# EAGLE design picade (EAGLE 6.6.0)
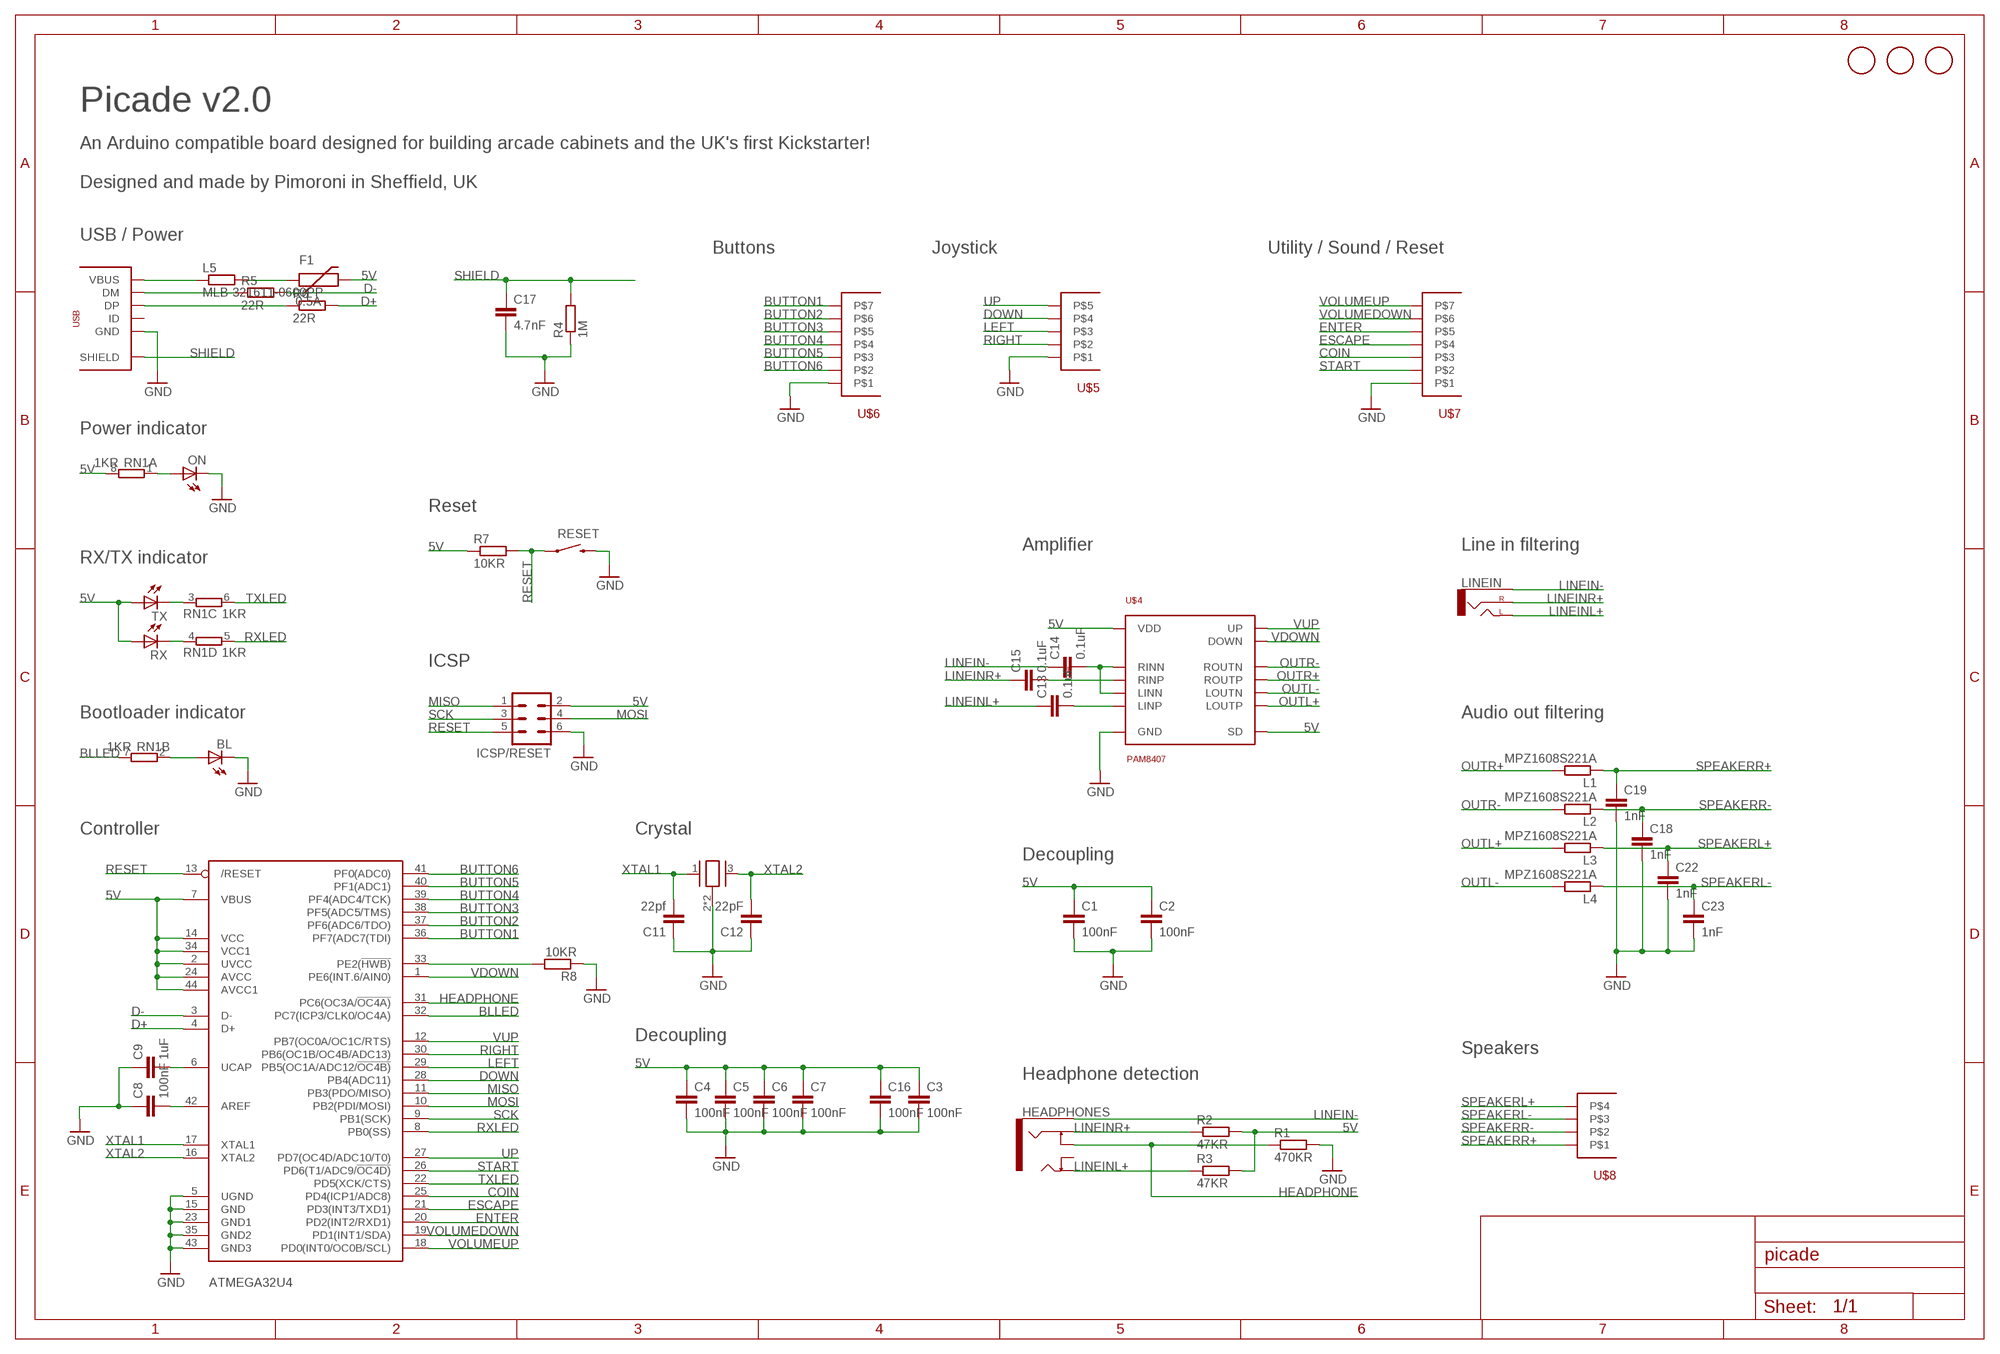
[diagram p0: schematic, sheet 1]

## Parts
16MHZ  TSX-3225  [TSX-3225]
ATMEGA32U4  ATMEGA32U4-AU  [TQFP44]
BL  LEDCHIPLED_0805  [CHIPLED_0805]
C1  100nF  C-EUC0603K  [C0603K]
C2  100nF  C-EUC0603K  [C0603K]
C3  100nF  C-EUC0603K  [C0603K]
C4  100nF  C-EUC0603K  [C0603K]
C5  100nF  C-EUC0603K  [C0603K]
C6  100nF  C-EUC0603K  [C0603K]
C7  100nF  C-EUC0603K  [C0603K]
C8  100nF  C-EUC0603K  [C0603K]
C9  1uF  C-EUC0603K  [C0603K]
C11  22pf  C-EUC0603K  [C0603K]
C12  22pF  C-EUC0603K  [C0603K]
C13  0.1uF  C-EUC0603K  [C0603K]
C14  0.1uF  C-EUC0603K  [C0603K]
C15  0.1uF  C-EUC0603K  [C0603K]
C16  100nF  C-EUC0805K  [C0805K]
C17  4.7nF  C-EUC0603K  [C0603K]
C18  1nF  C-EUC0603K  [C0603K]
C19  1nF  C-EUC0603K  [C0603K]
C22  1nF  C-EUC0603K  [C0603K]
C23  1nF  C-EUC0603K  [C0603K]
F1  0.5A  PTCSMD  [PTC-1206]
HEADPHONES  stereo-jack-switched  AUDIO-JACK2SMD  [AUDIO-JACK-3.5MM-SMD]
ICSP/RESET  MA03-2  [MA03-2]
L1  MPZ1608S221A  R-EU_R0603  [R0603]
L2  MPZ1608S221A  R-EU_R0603  [R0603]
L3  MPZ1608S221A  R-EU_R0603  [R0603]
L4  MPZ1608S221A  R-EU_R0603  [R0603]
L5  MLB-321611-0600PP  R-EU_R1206  [R1206]
LINEIN  stereo-jack-noswitch  AUDIO-JACKSMD2  [AUDIO-JACK-3.5MM-SMD]
ON  LEDCHIPLED_0805  [CHIPLED_0805]
R1  470KR  R-EU_R0603  [R0603]
R2  47KR  R-EU_R0603  [R0603]
R3  47KR  R-EU_R0603  [R0603]
R4  1M  R-EU_R0603  [R0603]
R5  22R  R-EU_R0603  [R0603]
R6  22R  R-EU_R0603  [R0603]
R7  10KR  R-EU_R0603  [R0603]
R8  10KR  R-EU_R0603  [R0603]
RESET  gullwing-switch  SWITCH-MOMENTARY-2-SMD-1101NE  [TACTILE-SWITCH-1101NE]
RN1  1KR  4R-N0603-ARC  [0603-ARC]
RX  LEDCHIPLED_0805  [CHIPLED_0805]
TX  LEDCHIPLED_0805  [CHIPLED_0805]
U$1  FIDUCIAL1MM  [FIDUCIAL-1MM]
U$2  FIDUCIAL1MM  [FIDUCIAL-1MM]
U$3  FIDUCIAL1MM  [FIDUCIAL-1MM]
U$4  PAM8407  [SO-16]
U$5  5-WAY  [1X5-3.5MM-SCREWTERMINAL]
U$6  7-WAY  [1X7-3.5MM-SCREWTERMINAL]
U$7  7-WAY  [1X7-3.5MM-SCREWTERMINAL]
U$8  4-WAY  [1X4-3.5MM-SCREWTERMINAL]
U$13  USBMICROB  [MICROB-USB]

## Nets
5V: ATMEGA32U4.2(UVCC) ATMEGA32U4.7(VBUS) ATMEGA32U4.14(VCC) ATMEGA32U4.24(AVCC) ATMEGA32U4.34(VCC1) ATMEGA32U4.44(AVCC1) C1.1 C2.1 C3.1 C4.1 C5.1 C6.1 C7.1 C16.1 F1.2 ICSP/RESET.2 R2.2 R3.2 R7.1 RN1.8 RX.A TX.A U$4.3(SD) U$4.9(VDD) U$4.16(VDD)
BLLED: ATMEGA32U4.32(PC7(ICP3/CLK0/OC4A)) RN1.7
BUTTON1: ATMEGA32U4.36(PF7(ADC7(TDI)) U$6.7
BUTTON2: ATMEGA32U4.37(PF6(ADC6/TDO)) U$6.6
BUTTON3: ATMEGA32U4.38(PF5(ADC5/TMS)) U$6.5
BUTTON4: ATMEGA32U4.39(PF4(ADC4/TCK)) U$6.4
BUTTON5: ATMEGA32U4.40(PF1(ADC1)) U$6.3
BUTTON6: ATMEGA32U4.41(PF0(ADC0)) U$6.2
COIN: ATMEGA32U4.25(PD4(ICP1/ADC8)) U$7.3
D+: ATMEGA32U4.4(D+) R6.2
D-: ATMEGA32U4.3(D-) R5.2
DOWN: ATMEGA32U4.28(PB4(ADC11)) U$5.4
ENTER: ATMEGA32U4.20(PD2(INT2/RXD1)) U$7.5
ESCAPE: ATMEGA32U4.21(PD3(INT3/TXD1)) U$7.4
GND: 16MHZ.2(GND) 16MHZ.4(GND) ATMEGA32U4.5(UGND) ATMEGA32U4.15(GND) ATMEGA32U4.23(GND1) ATMEGA32U4.35(GND2) ATMEGA32U4.43(GND3) BL.C C1.2 C2.2 C3.2 C4.2 C5.2 C6.2 C7.2 C8.1 C9.1 C11.1 C12.1 C16.2 C17.2 C18.2 C19.2 C22.2 C23.2 ICSP/RESET.6 ON.C R1.2 R4.1 R8.1 RESET.P$2 U$4.6(GND) U$4.12(GND) U$4.13(GND) U$5.1 U$6.1 U$7.1 U$13.GND
HEADPHONE: ATMEGA32U4.31(PC6(OC3A/!OC4A)) HEADPHONES.RSH R1.1
LEFT: ATMEGA32U4.29(PB5(OC1A/ADC12/!OC4B)) U$5.3
LIENINLCAP: C13.2 U$4.8(LINP)
LINEIN-: C14.1 HEADPHONES.SLEEVE LINEIN.SLEEVE
LINEINL+: C13.1 HEADPHONES.TIP LINEIN.TIP(LEFT) R3.1
LINEINR+: C15.1 HEADPHONES.RING LINEIN.RING(RIGHT) R2.1
LINEINRCAP: C15.2 U$4.1(RINP)
MISO: ATMEGA32U4.11(PB3(PDO/MISO)) ICSP/RESET.1
MOSI: ATMEGA32U4.10(PB2(PDI/MOSI)) ICSP/RESET.4
N$1: ATMEGA32U4.6(UCAP) C9.2
N$2: ON.A RN1.1
N$3: R5.1 U$13.DM
N$4: R6.1 U$13.DP
N$5: ATMEGA32U4.42(AREF) C8.2
N$6: BL.A RN1.2
N$7: F1.1 L5.2
N$9: C14.2 U$4.2(RINN) U$4.7(LINN)
N$11: RN1.3 TX.C
N$12: RN1.4 RX.C
N$41: ATMEGA32U4.33(PE2(!HWB)) R8.2
OUTL+: L3.2 U$4.10(LOUTP)
OUTL-: L4.2 U$4.11(LOUTN)
OUTR+: L1.2 U$4.15(ROUTP)
OUTR-: L2.2 U$4.14(ROUTN)
RESET: ATMEGA32U4.13(/RESET) ICSP/RESET.5 R7.2 RESET.P$1
RIGHT: ATMEGA32U4.30(PB6(OC1B/OC4B/ADC13)) U$5.2
RXLED: ATMEGA32U4.8(PB0(SS)) RN1.5
SCK: ATMEGA32U4.9(PB1(SCK)) ICSP/RESET.3
SHIELD: C17.1 R4.2 U$13.SH1(SHIELD) U$13.SH2(SHIELD) U$13.SH3(SHIELD) U$13.SH4(SHIELD) U$13.SH5(SHIELD) U$13.SH6(SHIELD) U$13.SH7(SHIELD) U$13.SH8(SHIELD)
SPEAKERL+: C22.1 L3.1 U$8.4
SPEAKERL-: C23.1 L4.1 U$8.3
SPEAKERR+: C19.1 L1.1 U$8.1
SPEAKERR-: C18.1 L2.1 U$8.2
START: ATMEGA32U4.26(PD6(T1/ADC9/!OC4D)) U$7.2
TXLED: ATMEGA32U4.22(PD5(XCK/CTS)) RN1.6
UP: ATMEGA32U4.27(PD7(OC4D/ADC10/T0)) U$5.5
VBUS: L5.1 U$13.VBUS
VDOWN: ATMEGA32U4.1(PE6(INT.6/AIN0)) U$4.5(DOWN)
VOLUMEDOWN: ATMEGA32U4.19(PD1(INT1/SDA)) U$7.6
VOLUMEUP: ATMEGA32U4.18(PD0(INT0/OC0B/SCL)) U$7.7
VUP: ATMEGA32U4.12(PB7(OC0A/OC1C/RTS)) U$4.4(UP)
XTAL1: 16MHZ.1(XIN) ATMEGA32U4.17(XTAL1) C11.2
XTAL2: 16MHZ.3(XOUT) ATMEGA32U4.16(XTAL2) C12.2
Unconnected: HEADPHONES.TSH U$13.ID

## Notes on the sheet
- Picade v2.0
- An Arduino compatible board designed for building arcade cabinets and the UK's first Kickstarter!
  
  Designed and made by Pimoroni in Sheffield, UK
- USB / Power
- Buttons | Joystick | Utility / Sound / Reset
- Power indicator
- Reset
- Amplifier | Line in filtering
- RX/TX indicator
- ICSP
- Bootloader indicator | Audio out filtering
- Controller | Crystal
- Decoupling
- Decoupling
- Speakers
- Headphone detection

## Library data of the parts
16MHZ = pimoroni:TSX-3225
ATMEGA32U4 = pimoroni:ATMEGA32U4: http://www.ladyada.net/library/eagle
BL ON RX TX = adafruit:LED: LED OSRAM: - CHIPLED LG R971, LG N971, LY N971, LG Q971, LY Q971, LO R971, LY R971 LH N974, LH R974 LS Q976, LO Q976, LY Q976 LO Q996 - Hyper CHIPLED LW Q18S LB Q993, LB Q99A, LB R99A - SideLED LS A670, LO A670, LY A670, LG A670, LP A670 LB A673, LV A673, LT A673, LW A673 LH A674 LY A675 LS A676, LA A676, LO A676, LY A676, LW A676 LS A679, LY A679, LG A679 - Hyper Micro SIDELED® LS Y876, LA Y876, LO Y876, LY Y876 LT Y87S - SmartLED LW L88C, LW L88S LB L89C, LB L89S, LG L890 LS L89K, LO L89K, LY L89K LS L896, LA L896, LO L896, LY L896 - TOPLED LS T670, LO T670, LY T670, LG T670, LP T670 LSG T670, LSP T670, LSY T670, LOP T670, LYG T670 LG T671, LOG T671, LSG T671 LB T673, LV T673, LT T673, LW T673 LH T674 LS T676, LA T676, LO T676, LY T676, LB T676, LH T676, LSB T676, LW T676 LB T67C, LV T67C, LT T67C, LS T67K, LO T67K, LY T67K, LW E67C LS E67B, LA E67B, LO E67B, LY E67B, LB E67C, LV E67C, LT E67C LW T67C LS T679, LY T679, LG T679 LS T770, LO T770, LY T770, LG T770, LP T770 LB T773, LV T773, LT T773, LW T773 LH T774 LS E675, LA E675, LY E675, LS T675 LS T776, LA T776, LO T776, LY T776, LB T776 LHGB T686 LT T68C, LB T68C - Hyper Mini TOPLED® LB M676 - Mini TOPLED Santana® LG M470 LS M47K, LO M47K, LY M47K Source: http://www.osram.convergy.de/
C1-C9 C11-C19 C22 C23 = resistor:C-EU: CAPACITOR, European symbol
F1 = SparkFun-PowerIC:PTC: Resettable Fuse PTC Resettable Fuse. Spark Fun Electronics SKU : COM-08357
HEADPHONES = pimoroni:AUDIO-JACK2: Stereo audio jack with bypass switches.
ICSP/RESET = con-lstb:MA03-2: PIN HEADER; OC_FARNELL: unknown; OC_NEWARK: unknown
L1-L4 R1-R8 = resistor:R-EU_: RESISTOR, European symbol
L5 = rcl:R-EU_: RESISTOR, European symbol
LINEIN = SparkFun-Connectors:AUDIO-JACK: 3.5mm Audio Jack Simple 3.5mm common PCB mount audio jack. SKU: PRT-08032
RESET = SparkFun-Electromechanical:SWITCH-MOMENTARY-2: Various NO switches- pushbuttons, reed, etc
RN1 = resistor-dil:4R-N: Array Chip Resistor Source: RS Component / Phycomp; OC_FARNELL: unknown; OC_NEWARK: unknown
U$1-U$3 = pimoroni:FIDUCIAL: 2mm fiducial for pick and place
U$4 = pimoroni:PAM8407
U$5 = pimoroni-headers:5-WAY
U$6 U$7 = pimoroni-headers:7-WAY
U$8 = pimoroni-headers:4-WAY
U$13 = pimoroni-connectors:USB

## Board
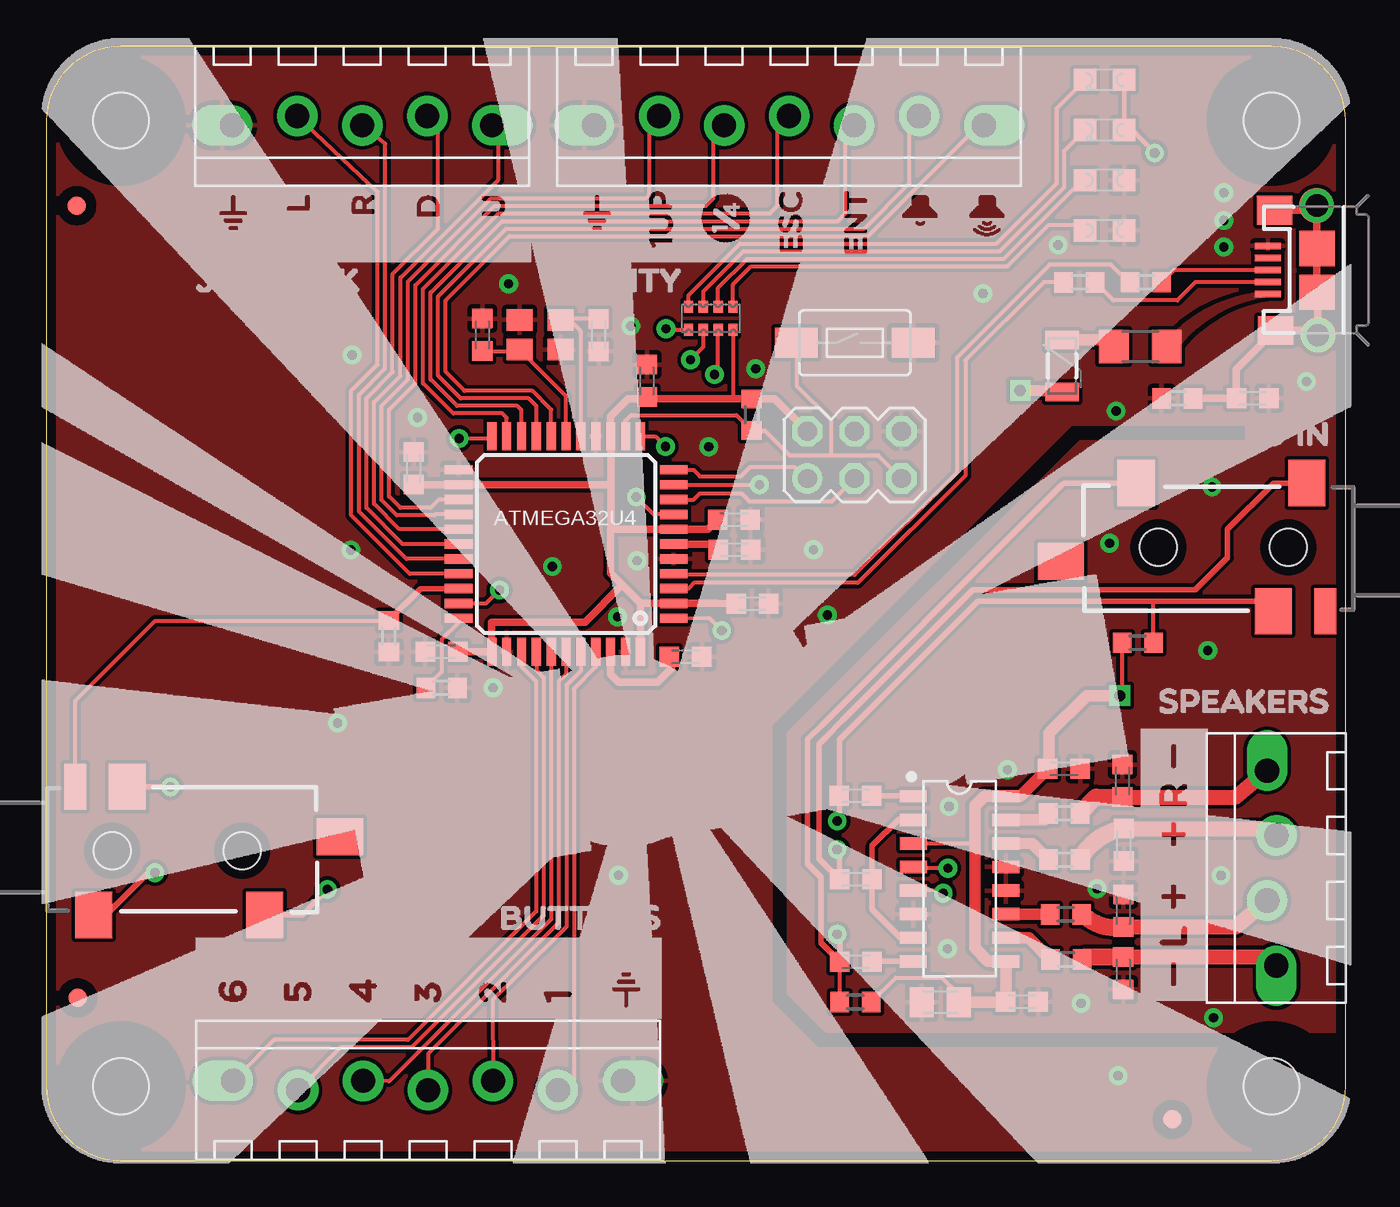
[diagram p1: board, top side]
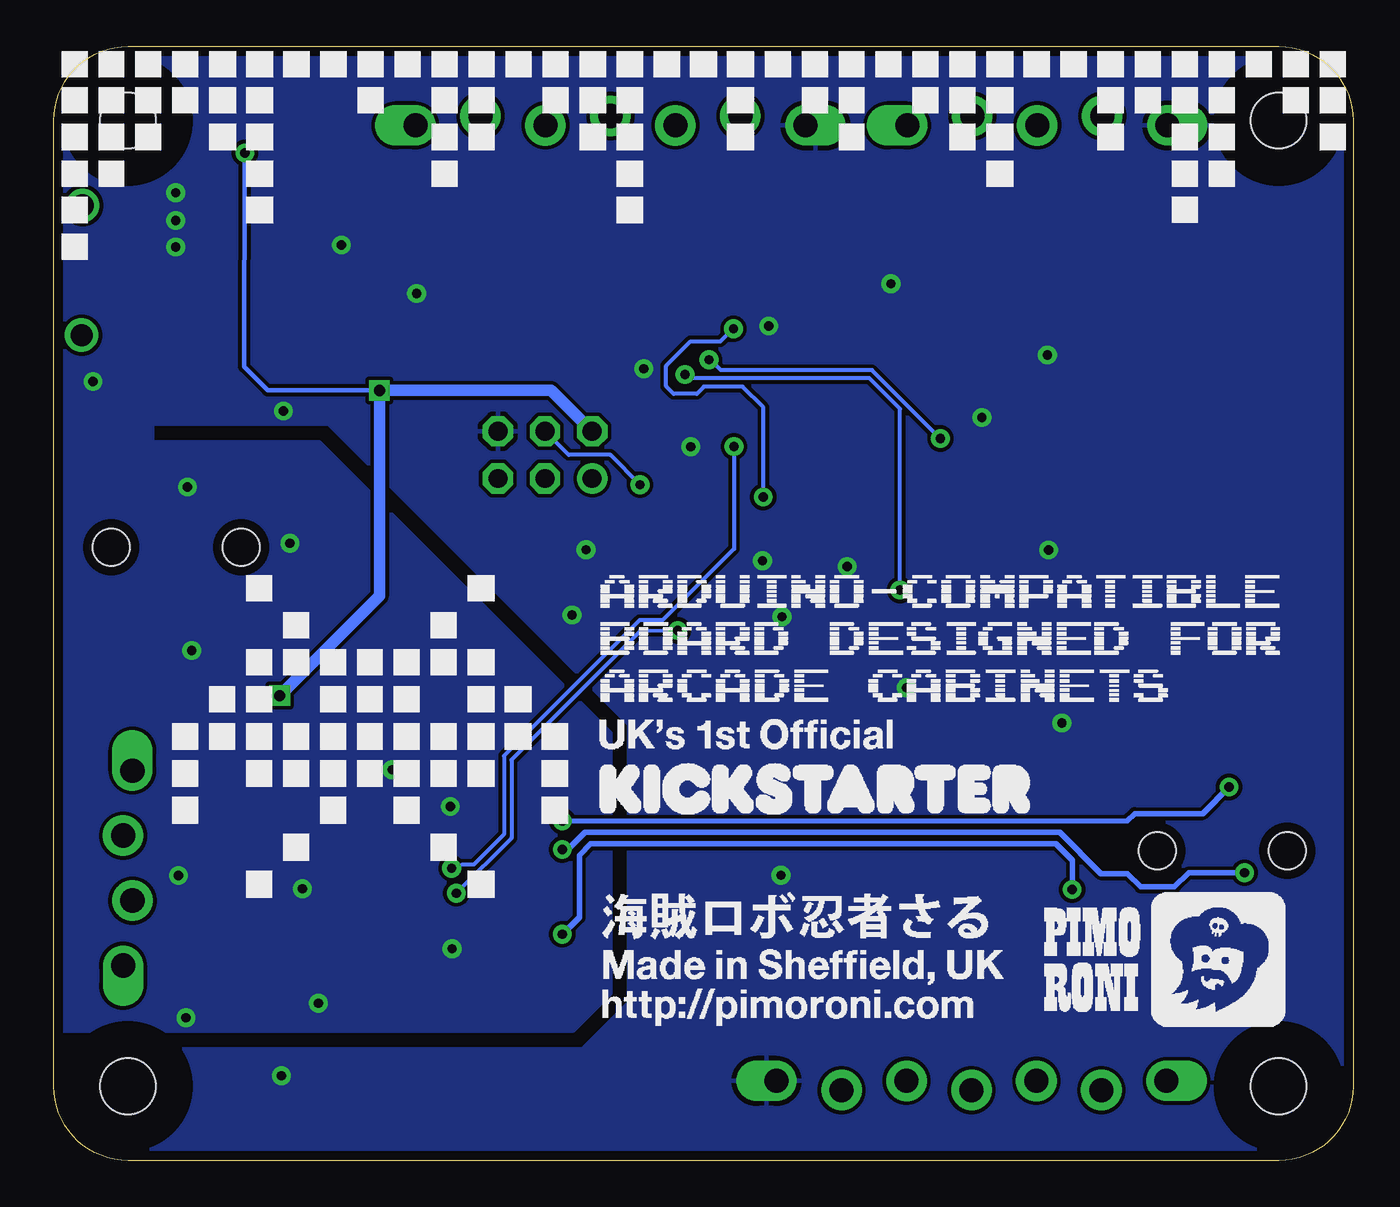
[diagram p2: board, bottom side, seen from below]

Size 70 x 60 mm. Coordinates in mm from the lower left corner, seen from the top.
Outline: 70,4 70,56 arc90 66,60 4,60 arc90 0,56 0,4 arc90 4,0 66,0 arc90 70,4
Copper layers (1*16): Top 0.035mm / dielectric 1.5mm / Bottom 0.035mm
Design rules "pimoroni *": minimum track width 8mil, minimum drill 12mil, track to track 8mil, track to pad 10mil, pad to pad 8mil, via to via 10mil, smd to smd 6mil, copper to edge 20mil, drill to drill 6mil, minimum pad ring 12mil, minimum via ring 10mil, stop-mask expansion 2mil, vias tented up to drill 25mil, thermal gap 10mil

### Footprints (pad centres in the part's own frame; a part is rotated, then mirrored left to right if it is on the bottom)
TSX-3225 = smd 1.4 x 1.15: 1 -1.1,-0.8; 2 1.1,-0.8; 3 1.1,0.8; 4 -1.1,0.8
TQFP44 = smd 1.5 x 0.5: 1 -5.8,4; 2 -5.8,3.2; 3 -5.8,2.4; 4 -5.8,1.6; 5 -5.8,0.8; 6 -5.8,0; 7 -5.8,-0.8; 8 -5.8,-1.6; 9 -5.8,-2.4; 10 -5.8,-3.2; 11 -5.8,-4; 23 5.8,-4; 24 5.8,-3.2; 25 5.8,-2.4; 26 5.8,-1.6; 27 5.8,-0.8; 28 5.8,0; 29 5.8,0.8; 30 5.8,1.6; 31 5.8,2.4; 32 5.8,3.2; 33 5.8,4 | smd 0.5 x 1.5: 12 -4,-5.8; 13 -3.2,-5.8; 14 -2.4,-5.8; 15 -1.6,-5.8; 16 -0.8,-5.8; 17 0,-5.8; 18 0.8,-5.8; 19 1.6,-5.8; 20 2.4,-5.8; 21 3.2,-5.8; 22 4,-5.8; 34 4,5.8; 35 3.2,5.8; 36 2.4,5.8; 37 1.6,5.8; 38 0.8,5.8; 39 0,5.8; 40 -0.8,5.8; 41 -1.6,5.8; 42 -2.4,5.8; 43 -3.2,5.8; 44 -4,5.8
CHIPLED_0805 = smd 1.2 x 1.2: A 0,-1.05; C 0,1.05
C0603K = smd 1.05 x 1.08: 1 -0.875,0; 2 0.875,0
C0805K = smd 1.3 x 1.6: 1 -1,0; 2 1,0
PTC-1206 = smd 1 x 1.8: 1 -1.4,0; 2 1.4,0
AUDIO-JACK-3.5MM-SMD = smd 2 x 2.5: RING 4.3,3.45; SLEEVE 2.5,-3.45; TIP 11.7,-3.45 | smd 1.2 x 2.5: RSH 1.5,3.45 | smd 2.5 x 2: TSH 15.75,0.75 | hole 2: 3.5,0; 10.5,0
MA03-2 = drill 1.016: 1 -2.54,-1.27 | drill 1.016 octagon: 2 -2.54,1.27; 3 0,-1.27; 4 0,1.27; 5 2.54,-1.27; 6 2.54,1.27
R0603 = smd 1 x 1.1: 1 -0.85,0; 2 0.85,0
R1206 = smd 1.6 x 1.803: 1 -1.422,0; 2 1.422,0
TACTILE-SWITCH-1101NE = smd 2.3 x 1.6: P$1 -3.15,0; P$2 3.15,0
0603-ARC = smd 0.5 x 0.65: 1 -1.2,-0.625; 2 -0.4,-0.625; 3 0.4,-0.625; 4 1.2,-0.625; 5 1.2,0.625; 6 0.4,0.625; 7 -0.4,0.625; 8 -1.2,0.625
FIDUCIAL-1MM = smd 1 x 1: 1 0,0
SO-16 = smd 0.67 x 1.45: 1 -4.445,-2.5; 2 -3.175,-2.5; 3 -1.905,-2.5; 4 -0.635,-2.5; 5 0.635,-2.5; 6 1.905,-2.5; 7 3.175,-2.5; 8 4.445,-2.5; 9 4.445,2.5; 10 3.175,2.5; 11 1.905,2.5; 12 0.635,2.5; 13 -0.635,2.5; 14 -1.905,2.5; 15 -3.175,2.5; 16 -4.445,2.5
1X5-3.5MM-SCREWTERMINAL = drill 1.3 pad 2.184 offset: 1 -7,-0.25; 5 7,-0.25 | drill 1.3 pad 2.184: 2 -3.5,0.25; 3 0,-0.25; 4 3.5,0.25
1X7-3.5MM-SCREWTERMINAL = drill 1.3 pad 2.184 offset: 1 -10.5,-0.25; 7 10.5,-0.25 | drill 1.3 pad 2.184: 2 -7,0.25; 3 -3.5,-0.25; 4 0,0.25; 5 3.5,-0.25; 6 7,0.25
1X4-3.5MM-SCREWTERMINAL = drill 1.3 pad 2.184 offset: 1 -5.25,-0.25; 4 5.25,0.25 | drill 1.3 pad 2.184: 2 -1.75,0.25; 3 1.75,-0.25
M3-MOUNTING-HOLE = hole 3: 0,0
MICROB-USB = smd 0.35 x 1.4: DM -0.65,2.65; DP 0,2.65; GND 1.3,2.65; ID 0.65,2.65; VBUS -1.3,2.65 | smd 1.546 x 1.9: SH1 -3.251,2.235; SH2 3.226,2.286 | drill 1.2 pad 1.6: SH3 3.48,0; SH8 -3.505,-0.051 | smd 1.9 x 1.9: SH4 3.48,0.025; SH5 1.168,0; SH6 -1.194,0; SH7 -3.505,-0.051

### Placement (x,y rotation side)
16MHZ  26.59,44.47 0 top
ATMEGA32U4  28,33.2 180 top
BL  57.01,52.8 270 top
C1  54.83,21.1 0 top
C2  52.56,8.55 0 top
C3  37.05,34.51 0 top
C4  38.03,29.98 0 top
C5  19.78,37.28 90 top
C6  32.36,41.99 90 top
C7  21.28,27.4 180 top
C8  34.44,27.13 180 top
C9  37.06,32.88 180 top
C11  23.49,44.47 270 top
C12  29.76,44.45 90 top
C13  43.62,10.71 0 top
C14  43.61,15.14 0 top
C15  43.6,19.64 0 top
C16  48.16,8.52 180 top
C17  64.99,41.05 0 top
C18  58.04,17 270 top
C19  57.98,20.44 90 top
C22  58.01,10.09 270 top
C23  58.02,13.45 90 top
F1  54.72,42.79 270 top
HEADPHONES  0.05,16.68 0 top
ICSP/RESET  43.53,38 0 top
L1  54.83,18.7 180 top
L2  54.85,16.2 180 top
L3  54.95,10.82 180 top
L4  54.92,13.26 180 top
L5  58.93,43.85 180 top
LINEIN  70.4,33.03 180 top
ON  57.01,50.09 270 top
R1  18.44,28.23 270 top
R2  58.79,27.88 180 top
R3  43.58,8.53 0 top
R4  60.93,41.05 0 top
R5  55.66,47.3 180 top
R6  59.24,47.3 180 top
R7  38,40.16 270 top
R8  21.28,25.45 180 top
RESET  43.56,44.04 0 top
RN1  35.79,45.36 180 top
RX  57.01,58.2 90 top
TX  57.01,55.5 90 top
U$1  1.63,51.42 0 top
U$2  60.66,2.21 0 top
U$3  1.68,8.75 0 top
U$4  49.2,15.17 270 top
U$5  17.01,56 0 top
U$6  20.56,4.04 180 top
U$7  40.01,56 0 top
U$8  66.01,15.75 270 top
U$9  [M3-MOUNTING-HOLE]  4.01,56 0 top
U$10  [M3-MOUNTING-HOLE]  4.01,4 0 top
U$11  [M3-MOUNTING-HOLE]  66.01,4 0 top
U$12  [M3-MOUNTING-HOLE]  66.01,56 0 top
U$13  68.45,47.96 90 top

### Tracks (layer width: path | path; a pad name or v marks a point on that pad's centre or on a via)
5V  (via drill 0.5, 0.6)
  Top 0.203: 32.44,34.1 32.34,34 | RN1.8 36.99,41.04 37.01,41.02 | U$4.16 | 51.65,8.52 C2.1 | U$4.3 49.46,17.08 50.02,17.08 | R3.2 45.75,9.86 48.25,9.86 49.16,8.94 C16.1 | R2.2 57.94,25.15 v57.83,25.04
  Top 0.254: RX.A TX.A 58.51,55.5 v59.71,54.25
  Top 0.406: ATMEGA32U4.2 36.14,30 C4.1 | C7.1 ATMEGA32U4.34 24,28.98 24.01,29 29.01,29 31.01,31 | 32.01,30 32.01,27.41 ATMEGA32U4.44 | ATMEGA32U4.2 | 30.39,34 32.02,34 32.34,34 ATMEGA32U4.7 35.63,34 C3.1 | 30.39,34 30.41,34.05 30.41,35.58 30.41,36.47 | 30.41,36.47 30.41,38.98 ATMEGA32U4.14 30.38,39.01 30.38,40.07 31.35,41.04 32.26,41.04 C6.1 32.07,41.02 36.97,41.02 36.99,41.04 | 30.41,36.47 30.34,36.4 ATMEGA32U4.24 C5.1 | 37.01,41.02 38.01,41.02 | 38.01,41.02 39.24,41.02 ICSP/RESET.2 | R7.1 38.01,41.02 | 32.01,30 ATMEGA32U4.2 | 30.39,34 30.39,31.62 31.01,31 | 31.01,31 32.01,30
  Top 0.61: C2.1 51.7,8.57 U$4.9 50.73,10.73 50.02,11.45 50.02,17.08 50.02,19.12 50.52,19.62 U$4.16 | F1.2 54.65,41.43 v52.45,41.47 | 51.65,8.52 C16.1 | v57.83,25.04 56.05,25.04 54.01,23 54.01,21.16 C1.1 52.47,19.62 U$4.16
  Bottom 0.254: v52.45,41.47 58.48,41.47 59.73,42.75 v59.71,54.25
  Bottom 0.61: ICSP/RESET.2 43.2,41.47 v52.45,41.47 52.45,30.41 v57.83,25.04
BLLED  (via drill 0.5)
  Top 0.203: ATMEGA32U4.32 23.69,30 v24.41,30.73 | v35.99,42.33 36.19,42.69 RN1.7
  Bottom 0.203: v24.41,30.73 24.41,40.48 26.06,42.13 35.68,42.14 v35.99,42.33
BUTTON1
  Top 0.203: ATMEGA32U4.36 25.6,26.59 26.39,25.81 26.39,13.41 19.48,6.5 12.27,6.5 U$6.7
BUTTON2
  Top 0.203: ATMEGA32U4.37 26.4,26.41 26.79,26.01 26.79,13.21 19.68,6.1 15.86,6.1 U$6.6
BUTTON3
  Top 0.203: ATMEGA32U4.38 27.2,13.01 18.46,4.27 U$6.5
BUTTON4
  Top 0.203: ATMEGA32U4.39 28,26.2 27.61,25.81 27.61,12.8 22.12,7.32 20.57,5.76 U$6.4
BUTTON5
  Top 0.203: ATMEGA32U4.40 28.8,26.39 28.01,25.6 28.01,12.6 25.37,9.96 24.05,8.66 U$6.3
BUTTON6
  Top 0.203: ATMEGA32U4.41 29.6,26.58 28.42,25.4 28.42,4.34 U$6.2
COIN
  Top 0.203: ATMEGA32U4.25 21.14,35.6 20.7,35.15 19.07,35.15 18.46,35.76 18.46,40.44 19.88,41.86 19.88,47.14 24.15,51.41 35.53,51.41 35.94,51.82 35.94,55.52 U$7.3
D+
  Top 0.203: R6.2 58.31,47.3 57.36,48.25 54.06,48.25 49.04,43.23 49.04,37.04 43.54,31.54 33.86,31.54 ATMEGA32U4.4
D-
  Top 0.203: R5.2 54.86,47.3 54.77,47.31 53.73,47.31 49.51,43.09 49.51,36.87 43.72,31.11 34.88,31.11 34.6,30.8 33.87,30.8 ATMEGA32U4.3
DOWN
  Top 0.203: ATMEGA32U4.28 19.2,33.2 17.24,35.15 17.24,41.05 18.66,42.47 18.66,47.75 21.1,50.19 21.1,55.9 U$5.4
ENTER
  Top 0.203: ATMEGA32U4.20 25.6,40.41 25.37,40.64 22.12,40.64 20.7,42.06 20.7,46.74 24.56,50.6 42.64,50.6 43.05,51 43.05,55.46 U$7.5
ESCAPE
  Top 0.203: ATMEGA32U4.21 24.8,39.99 24.56,40.23 21.92,40.23 20.29,41.86 20.29,46.94 24.35,51 38.98,51 39.39,51.41 39.39,55.98 U$7.4
GND  (via drill 0.5)
  other vias: 16.41,32.89 27.26,32 42.07,29.38 35.68,38.43 38.22,42.64 31.48,44.94 24.06,25.46 15.69,23.57 16.47,43.37 50.45,46.7 62.8,36.27 63.43,50.62 31.82,32.3 20,40.01 57.74,4.56 24.9,47.22 41.33,32.9 57.28,33.24 62.57,27.46 51.78,21.04 48.54,11.41 48.64,19.06 63.29,15.34 62.88,7.69 55.75,8.47 67.89,41.96 30.82,15.37 56.61,14.63 63.43,49.2 63.43,52.12 54.51,49.3 57.63,40.36 30.77,29.28
  pour Bottom (rank 2): -2.19,62.06 71.81,62.06 72.01,7 42.01,7 40.01,9 40.01,23 55.7,38.69 64.7,38.69 64.7,39.69 55.2,39.69 39.01,23.5 39.01,8.5 41.51,6 72.01,6 72.01,-2 -1.99,-2
  pour Top (rank 2): -0.99,61.06 71.01,61.06 71.01,7 42.01,7 40.01,9 40.01,23 55.7,38.69 64.7,38.69 64.7,39.69 55.2,39.69 39.01,23.5 39.01,8.5 41.51,6 71.01,6 71.01,-1 -0.99,-1
HEADPHONE
  Top 0.203: HEADPHONES.RSH 1.55,24.75 5.86,29.06 18.41,29.06 R1.1
  Top 0.305: ATMEGA32U4.31 20.15,30.8 R1.1
LEFT
  Top 0.203: ATMEGA32U4.29 19.39,32.4 16.84,34.95 16.84,41.25 18.26,42.67 18.26,54.75 U$5.3
LIENINLCAP
  Top 0.203: 44.51,10.73 C13.2
  Top 0.305: U$4.8 44.51,10.73
LINEIN-  (via drill 0.5)
  Top 0.305: LINEIN.SLEEVE 66.12,36.48 63.63,33.99 63.63,32.47 61.89,30.73 49.91,30.73 42.87,23.68 42.01,22.79 41.63,22.42 41.63,16.25 C14.1 42.74,16.62 v42.6,16.75 | v5.85,15.49 5.47,15.49 3.1,13.13 2.57,13.21 HEADPHONES.SLEEVE
  Bottom 0.305: v42.6,16.75 42.29,16.75 41.38,17.67 15.81,17.67 13.59,15.45 12.16,15.45 11.45,14.73 9.62,14.73 8.86,15.5 v5.85,15.49
LINEINL+  (via drill 0.5)
  Top 0.203: R3.1 42.74,8.54 C13.1
  Top 0.305: LINEIN.TIP 54.91,36.48 54.83,36.48 54.71,36.38 51.92,33.6 42.64,24.32 41.78,23.45 41,22.68 41,15.99 41.74,15.26 41.74,11.72 C13.1 42.74,12.04 v42.6,12.18 | v15.13,14.6 13.81,13.23 HEADPHONES.TIP
  Bottom 0.305: v42.6,12.18 41.68,13.1 41.68,16.45 41.07,17.06 16.01,17.06 15.12,16.17 15.12,14.55 v15.13,14.6
LINEINR+  (via drill 0.5)
  Top 0.203: R2.1 59.64,30.02 59.55,30.12
  Top 0.305: LINEIN.RING 65.64,30.12 59.55,30.12 50.19,30.12 42.74,22.66 42.73,21.75 C15.1 42.72,18.4 v42.6,18.28 | v6.67,20.12 4.36,20.12 HEADPHONES.RING
  Bottom 0.305: v42.6,18.28 12.16,18.29 11.77,18.68 8.11,18.68 v6.67,20.12
LINEINRCAP
  Top 0.305: C15.2 46.67,19.64 U$4.1
MISO
  Top 0.203: ATMEGA32U4.11 34.86,37.2 35.21,36.85 37.42,36.85 37.93,37.36 40.29,37.36 40.44,37.2 ICSP/RESET.1
MOSI  (via drill 0.5)
  Top 0.203: ATMEGA32U4.10 v38.41,36.4
  Bottom 0.203: v38.41,36.4 40.01,38 42.27,38 ICSP/RESET.4
N$1
  Top 0.406: ATMEGA32U4.6 36.18,33.2 C9.2
N$2
  Top 0.203: RN1.1 36.99,47.18 37.97,48.16 51.79,48.16 54.02,50.39 55.86,50.39 ON.A
N$3
  Top 0.203: U$13.DM 61.91,47.3 60.93,46.33 57.48,46.33 R5.1
N$4
  Top 0.203: U$13.DP 60.75,47.95 R6.1
N$5
  Top 0.406: ATMEGA32U4.42 30.4,26.18 30.82,25.76 32.93,25.76 33.67,26.52 C8.2
N$6
  Top 0.203: RN1.2 36.19,46.99 37.77,48.56 51.58,48.56 55.65,52.63 55.65,52.68 BL.A
N$7
  Top 0.61: F1.1 57.3,44.21 L5.2
N$9
  Top 0.203: U$4.7 | 46.59,18.41 U$4.2
  Top 0.305: U$4.7 46.01,12 44.49,13.53 C14.2 44.49,16.94 45.93,18.38 46.59,18.41
N$11
  Top 0.203: RN1.3 35.39,46.8 37.56,48.97 51.38,48.97 54.83,52.43 54.83,54.37 TX.C
N$12
  Top 0.203: RN1.4 34.59,46.61 37.36,49.38 51.18,49.38 54.43,52.63 54.43,56.67 RX.C
N$41
  Top 0.203: ATMEGA32U4.33 22.2,28.96 21.29,28.06 21.29,26.31 R8.2
OUTL+
  Top 0.61: U$4.10 52.92,12 L3.2
OUTL-
  Top 0.61: U$4.11 53.67,13.27 L4.2
OUTR+
  Top 0.61: U$4.15 53.78,18.35 L1.2
OUTR-
  Top 0.61: U$4.14 53.13,17.05 L2.2
RESET
  Top 0.203: 42.29,37.99 40.03,37.99 38.71,39.31 R7.2 37.16,40.15 31.5,40.15 31.2,39.85 ATMEGA32U4.13 | 42.29,37.99 44.81,37.99 ICSP/RESET.5 | RESET.P$1 40.41,41.73 42.27,39.9 42.27,38.02 42.29,37.99
RIGHT
  Top 0.203: ATMEGA32U4.30 19.58,31.6 16.43,34.75 16.43,41.45 17.85,42.88 17.85,52.15 U$5.2
RXLED  (via drill 0.5)
  Top 0.203: ATMEGA32U4.8 32.71,34.8 v31.78,35.73 | v33.38,44.8 33.58,44.73 RN1.5
  Bottom 0.203: v31.78,35.73 31.78,40.56 32.9,41.67 34.98,41.67 35.36,41.29 36.6,41.29 37.01,41.7 37.01,42.79 35.69,44.11 34.09,44.11 v33.38,44.8
SCK
  Top 0.203: ATMEGA32U4.9 34.87,35.6 35.21,35.93 37.44,35.93 37.88,35.5 42.33,35.5 ICSP/RESET.3
SHIELD
  Top 0.406: R4.2 C17.1 64.12,42.61 U$13.SH1 68.25,44.7 U$13.SH7 68.5,46.71 U$13.SH6 U$13.SH5 68.45,51.41 U$13.SH4 | U$13.SH4 68.17,51.18 U$13.SH2 | U$13.SH3 U$13.SH4
SPEAKERL+
  Top 0.813: C22.1 66.05,10.97 U$8.4
  Top 0.914: L3.1 55.94,10.97 C22.1
SPEAKERL-
  Top 0.813: C23.1 64.09,12.58 U$8.3
  Top 0.914: L4.1 56.16,13 arc45 C23.1
SPEAKERR+
  Top 0.813: C19.1 64.08,19.57 U$8.1
  Top 0.914: L1.1 56.55,19.59 C19.1
SPEAKERR-
  Top 0.813: C18.1 66.14,17.88 U$8.2
  Top 0.914: L2.1 55.95,16.63 arc-45 C18.1
START
  Top 0.203: ATMEGA32U4.26 20.95,34.8 20.9,34.75 18.87,34.75 18.06,35.56 18.06,40.64 19.48,42.06 19.48,47.35 23.95,51.82 32.28,51.82 32.48,52.02 32.48,56.03 U$7.2
TXLED  (via drill 0.5)
  Top 0.203: ATMEGA32U4.22 24.01,38.88 v22.23,38.88 | v34.7,43.12 35.39,43.83 RN1.6
  Bottom 0.203: v22.23,38.88 25.91,42.56 34.06,42.56 34.67,43.17 v34.7,43.12
UP
  Top 0.203: ATMEGA32U4.27 19.01,34 17.65,35.36 17.65,40.84 19.07,42.27 19.07,47.55 24.35,52.83 24.35,55.33 U$5.5
VBUS
  pour Top (no thermals): 66.45,46.77 65.83,46.8 arc45 60.2,43.98 60.08,43.7 60.79,43.17 61.09,43.01 61.04,43.27 61.13,43.99 arc-45 65.84,46.54
VDOWN  (via drill 0.5)
  Top 0.203: ATMEGA32U4.1 35.7,29.22 v36.38,28.54 | v48.31,14.39 48.02,14.54 U$4.5
  Bottom 0.203: v36.38,28.54 38.41,28.52 45.34,21.58 45.34,17.36 v48.31,14.39
VOLUMEDOWN
  Top 0.203: ATMEGA32U4.19 26.4,40.63 25.98,41.05 22.32,41.05 21.1,42.27 21.1,46.53 24.76,50.19 44.06,50.19 46.5,52.63 46.5,56.01 U$7.6
VOLUMEUP
  Top 0.203: ATMEGA32U4.18 27.2,40.44 26.18,41.45 22.53,41.45 21.51,42.47 21.51,46.33 24.96,49.78 44.27,49.78 50.19,55.7 U$7.7
VUP  (via drill 0.5)
  Top 0.203: ATMEGA32U4.12 32.8,39 v33.35,38.45 | v48.57,15.74 46.77,15.74 U$4.4
  Bottom 0.203: v33.35,38.45 33.35,32.95 37.2,29.1 38.43,29.1 45.75,21.79 45.75,17.57 47.38,15.94 47.98,15.94 v48.57,15.74
XTAL1
  Top 0.203: ATMEGA32U4.17 28,41.16 16MHZ.1 25.41,43.59 C11.2
XTAL2
  Top 0.203: ATMEGA32U4.16 28.8,39.99 28.81,44.6 28.76,44.71 28.3,45.16 27.8,45.16 16MHZ.3 27.74,45.32 C12.2